# EAGLE design analog (EAGLE 7.4.0)
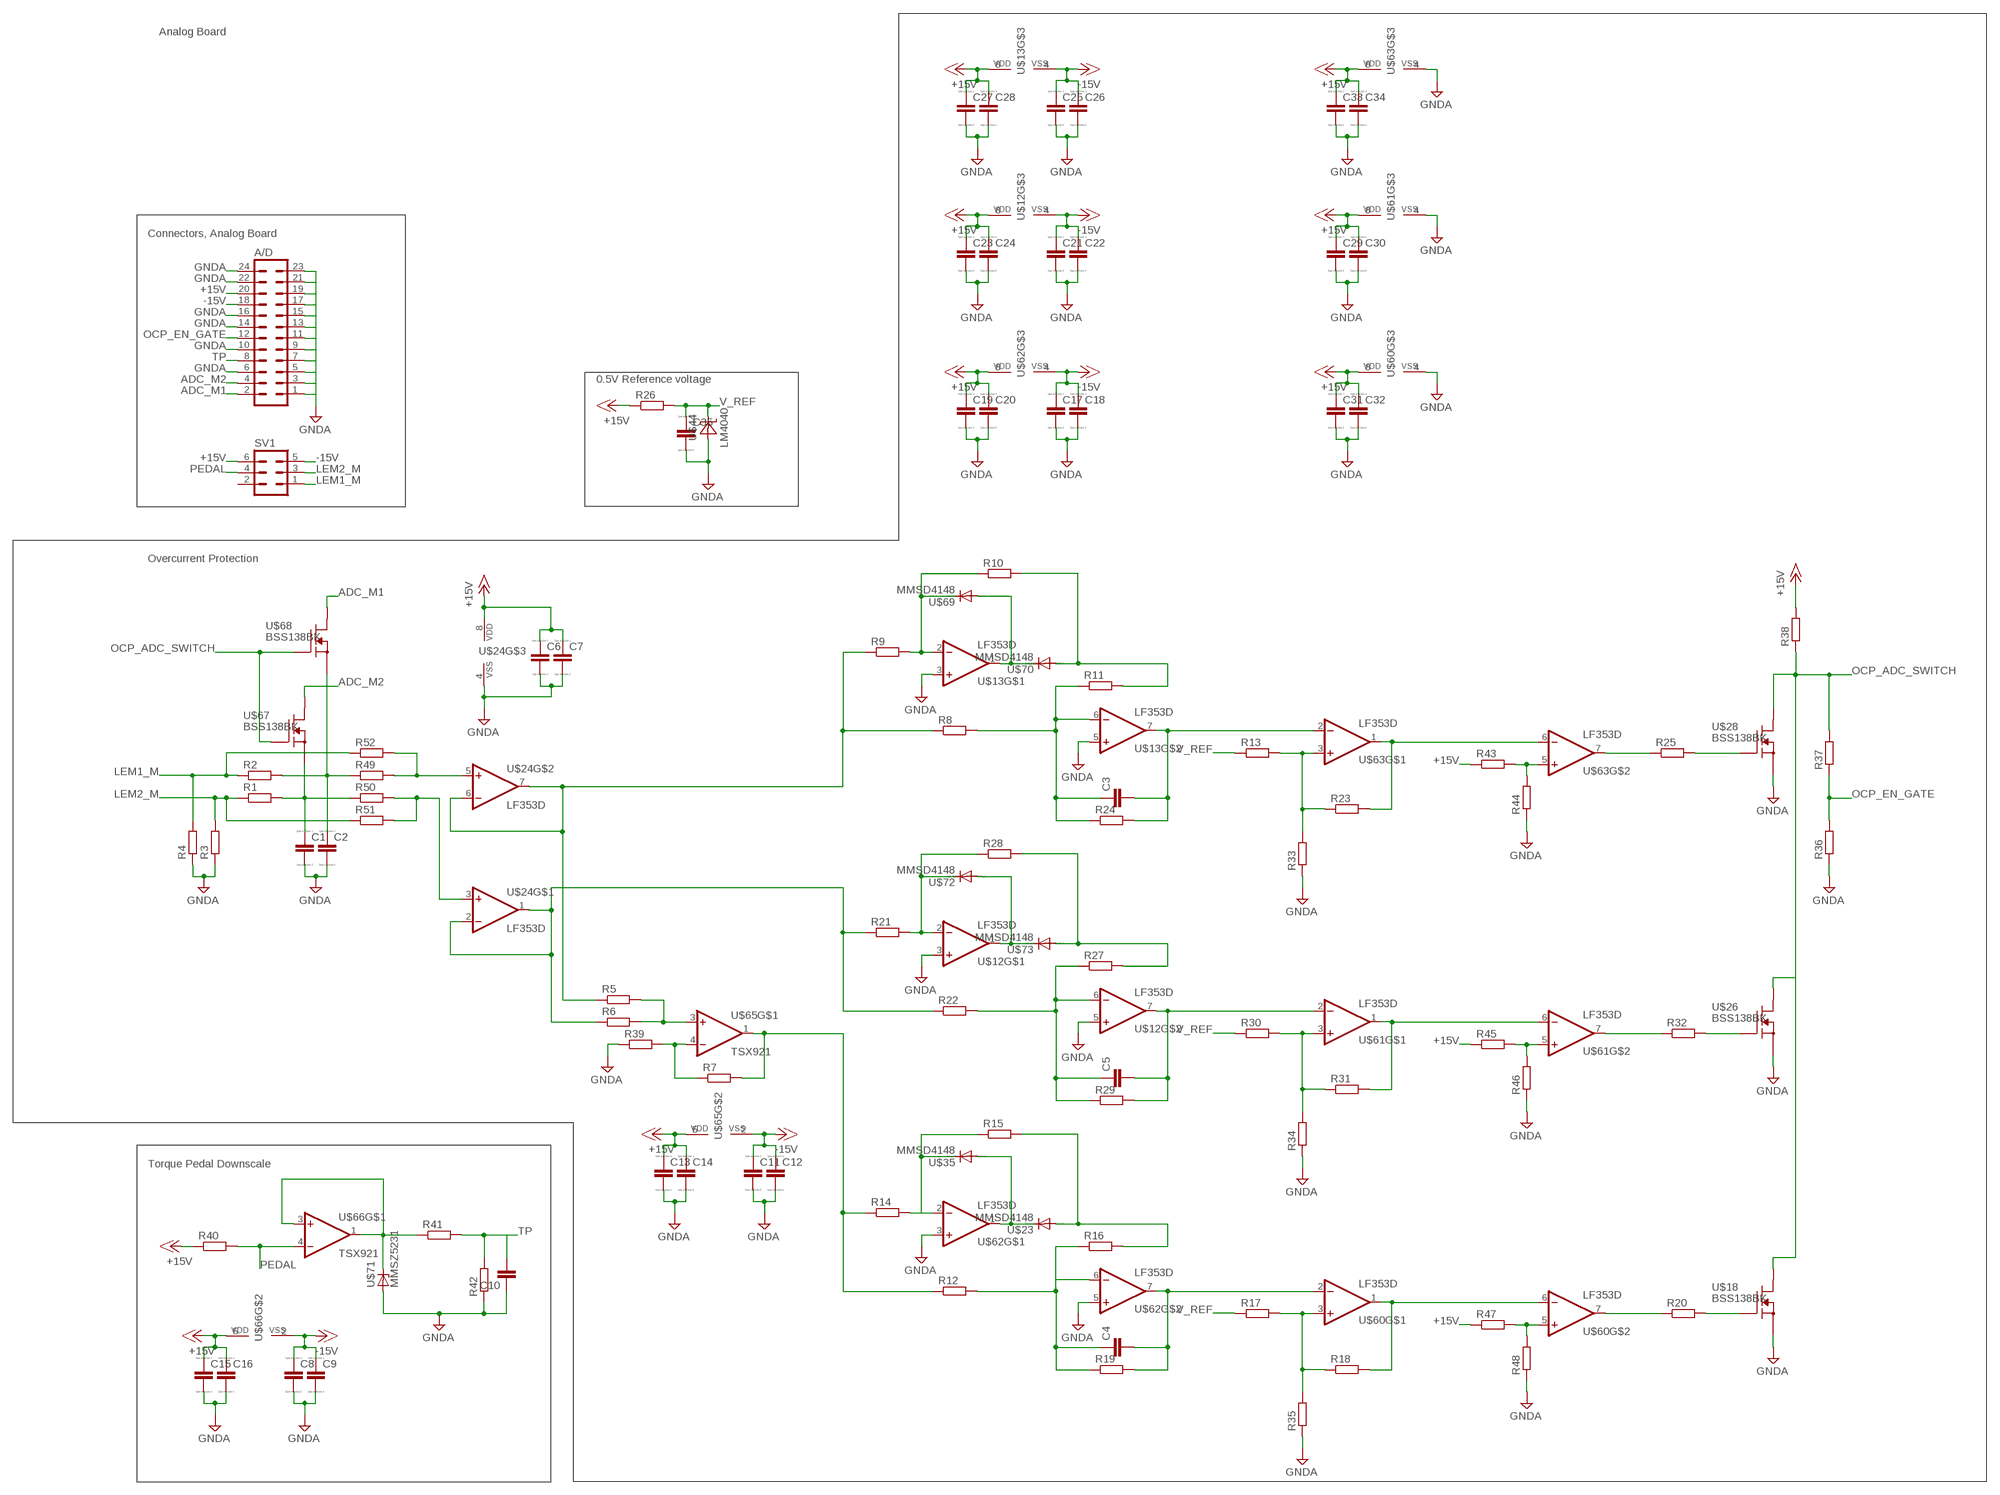
[diagram p0: schematic, sheet 1]

## Parts
A/D  MA12-2  [MA12-2]
C1  CC1206  [C1206]
C2  CC1206  [C1206]
C3  C-EUC0805  [C0805]
C4  C-EUC0805  [C0805]
C5  C-EUC0805  [C0805]
C6  CC1206  [C1206]
C7  CC1206  [C1206]
C8  CC1206  [C1206]
C9  CC1206  [C1206]
C10  C-EUC0805  [C0805]
C11  CC1206  [C1206]
C12  CC1206  [C1206]
C13  CC1206  [C1206]
C14  CC1206  [C1206]
C15  CC1206  [C1206]
C16  CC1206  [C1206]
C17  CC1206  [C1206]
C18  CC1206  [C1206]
C19  CC1206  [C1206]
C20  CC1206  [C1206]
C21  CC1206  [C1206]
C22  CC1206  [C1206]
C23  CC1206  [C1206]
C24  CC1206  [C1206]
C25  CC1206  [C1206]
C26  CC1206  [C1206]
C27  CC1206  [C1206]
C28  CC1206  [C1206]
C29  CC1206  [C1206]
C30  CC1206  [C1206]
C31  CC1206  [C1206]
C32  CC1206  [C1206]
C33  CC1206  [C1206]
C34  CC1206  [C1206]
C35  CC1206  [C1206]
R1  R-EU_M0805  [M0805]
R2  R-EU_M0805  [M0805]
R3  R-EU_M0805  [M0805]
R4  R-EU_M0805  [M0805]
R5  R-EU_M0805  [M0805]
R6  R-EU_M0805  [M0805]
R7  R-EU_M0805  [M0805]
R8  R-EU_M0805  [M0805]
R9  R-EU_M0805  [M0805]
R10  R-EU_M0805  [M0805]
R11  R-EU_M0805  [M0805]
R12  R-EU_M0805  [M0805]
R13  R-EU_M0805  [M0805]
R14  R-EU_M0805  [M0805]
R15  R-EU_M0805  [M0805]
R16  R-EU_M0805  [M0805]
R17  R-EU_M0805  [M0805]
R18  R-EU_M0805  [M0805]
R19  R-EU_M0805  [M0805]
R20  R-EU_M0805  [M0805]
R21  R-EU_M0805  [M0805]
R22  R-EU_M0805  [M0805]
R23  R-EU_M0805  [M0805]
R24  R-EU_M0805  [M0805]
R25  R-EU_M0805  [M0805]
R26  R-EU_M0805  [M0805]
R27  R-EU_M0805  [M0805]
R28  R-EU_M0805  [M0805]
R29  R-EU_M0805  [M0805]
R30  R-EU_M0805  [M0805]
R31  R-EU_M0805  [M0805]
R32  R-EU_M0805  [M0805]
R33  R-EU_M0805  [M0805]
R34  R-EU_M0805  [M0805]
R35  R-EU_M0805  [M0805]
R36  R-EU_M0805  [M0805]
R37  R-EU_M0805  [M0805]
R38  R-EU_M0805  [M0805]
R39  R-EU_M0805  [M0805]
R40  R-EU_M0805  [M0805]
R41  R-EU_M0805  [M0805]
R42  R-EU_M0805  [M0805]
R43  R-EU_M0805  [M0805]
R44  R-EU_M0805  [M0805]
R45  R-EU_M0805  [M0805]
R46  R-EU_M0805  [M0805]
R47  R-EU_M0805  [M0805]
R48  R-EU_M0805  [M0805]
R49  R-EU_M0805  [M0805]
R50  R-EU_M0805  [M0805]
R51  R-EU_M0805  [M0805]
R52  R-EU_M0805  [M0805]
SV1  MA03-2  [MA03-2]
U$12  LF353D  [SO08]
U$13  LF353D  [SO08]
U$18  BSS138BK  [SOT23]
U$23  MMSD4148  [SOD123]
U$24  LF353D  [SO08]
U$26  BSS138BK  [SOT23]
U$28  BSS138BK  [SOT23]
U$35  MMSD4148  [SOD123]
U$44  LM4040  [SOT23]
U$60  LF353D  [SO08]
U$61  LF353D  [SO08]
U$62  LF353D  [SO08]
U$63  LF353D  [SO08]
U$65  TSX921  [SOT23-5]
U$66  TSX921  [SOT23-5]
U$67  BSS138BK  [SOT23]
U$68  BSS138BK  [SOT23]
U$69  MMSD4148  [SOD123]
U$70  MMSD4148  [SOD123]
U$71  MMSZ5231  [SOD123]
U$72  MMSD4148  [SOD123]
U$73  MMSD4148  [SOD123]

## Nets
+15V: A/D.20 C6.1 C7.1 C13.1 C14.1 C15.1 C16.1 C19.1 C20.1 C23.1 C24.1 C27.1 C28.1 C29.1 C30.1 C31.1 C32.1 C33.1 C34.1 R26.1 R38.2 R40.1 R43.1 R45.1 R47.1 SV1.6 U$12.8(VDD) U$13.8(VDD) U$24.8(VDD) U$60.8(VDD) U$61.8(VDD) U$62.8(VDD) U$63.8(VDD) U$65.5(VDD) U$66.5(VDD)
-15V: A/D.18 C8.1 C9.1 C11.1 C12.1 C17.1 C18.1 C21.1 C22.1 C25.1 C26.1 SV1.5 U$12.4(VSS) U$13.4(VSS) U$62.4(VSS) U$65.2(VSS) U$66.2(VSS)
ADC_M1: A/D.2 U$68.3(D)
ADC_M2: A/D.4 U$67.3(D)
GNDA: A/D.1 A/D.3 A/D.5 A/D.6 A/D.7 A/D.9 A/D.10 A/D.11 A/D.13 A/D.14 A/D.15 A/D.16 A/D.22 A/D.23 A/D.24 C1.2 C2.2 C6.2 C7.2 C8.2 C9.2 C10.1 C11.2 C12.2 C13.2 C14.2 C15.2 C16.2 C17.2 C18.2 C19.2 C20.2 C21.2 C22.2 C23.2 C24.2 C25.2 C26.2 C27.2 C28.2 C29.2 C30.2 C31.2 C32.2 C33.2 C34.2 C35.2 R3.1 R4.1 R33.1 R34.1 R35.1 R36.1 R39.1 R42.1 R44.1 R46.1 R48.1 U$12.3(+IN) U$12.5(+IN) U$13.3(+IN) U$13.5(+IN) U$18.2(S) U$24.4(VSS) U$26.2(S) U$28.2(S) U$44.1(A) U$60.4(VSS) U$61.4(VSS) U$62.3(+IN) U$62.5(+IN) U$63.4(VSS) U$71.A
LEM1_M: R2.1 R4.2 R52.1 SV1.1
LEM2_M: R1.1 R3.2 R51.1 SV1.3
N$1: R50.2 R51.2 U$24.3(+IN)
N$2: R5.1 R8.1 R9.1 U$24.6(-IN) U$24.7(OUT)
N$3: R9.2 R10.1 U$13.2(-IN) U$69.C
N$4: C2.1 R2.2 R49.1 U$68.2(S)
N$5: R13.2 R23.1 R33.2 U$63.3(+IN)
N$6: R5.2 R6.2 U$65.3(+IN)
N$7: R7.2 R12.1 R14.1 U$65.1(OUT)
N$8: C3.1 R8.2 R11.1 R24.1 U$13.6(-IN)
N$9: R10.2 R11.2 U$70.A
N$10: C3.2 R24.2 U$13.7(OUT) U$63.2(-IN)
N$11: U$13.1(OUT) U$69.A U$70.C
N$12: R6.1 R21.1 R22.1 U$24.1(OUT) U$24.2(-IN)
N$13: R14.2 R15.1 U$35.C U$62.2(-IN)
N$14: C4.1 R12.2 R16.1 R19.1 U$62.6(-IN)
N$15: U$23.C U$35.A U$62.1(OUT)
N$16: R15.2 R16.2 U$23.A
N$17: C4.2 R19.2 U$60.2(-IN) U$62.7(OUT)
N$18: R23.2 U$63.1(OUT) U$63.6(-IN)
N$19: R17.2 R18.1 R35.2 U$60.3(+IN)
N$20: R18.2 U$60.1(OUT) U$60.6(-IN)
N$21: R32.1 U$61.7(OUT)
N$22: R7.1 R39.2 U$65.4(-IN)
N$23: R21.2 R28.1 U$12.2(-IN) U$72.C
N$24: C5.1 R22.2 R27.1 R29.1 U$12.6(-IN)
N$25: U$12.1(OUT) U$72.A U$73.C
N$26: R27.2 R28.2 U$73.A
N$27: C5.2 R29.2 U$12.7(OUT) U$61.2(-IN)
N$28: A/D.21
N$29: R30.2 R31.1 R34.2 U$61.3(+IN)
N$30: R31.2 U$61.1(OUT) U$61.6(-IN)
N$31: R45.2 R46.2 U$61.5(+IN)
N$32: R25.1 U$63.7(OUT)
N$33: R25.2 U$28.1(G)
N$34: R32.2 U$26.1(G)
N$35: R20.2 U$18.1(G)
N$36: A/D.19
N$37: R41.1 U$66.1(OUT) U$66.3(+IN) U$71.C
N$38: R43.2 R44.2 U$63.5(+IN)
N$39: R47.2 R48.2 U$60.5(+IN)
N$40: R20.1 U$60.7(OUT)
N$41: R49.2 R52.2 U$24.5(+IN)
N$42: C1.1 R1.2 R50.1 U$67.2(S)
N$43: A/D.17
OCP_ADC_SWITCH: R37.2 R38.1 U$18.3(D) U$26.3(D) U$28.3(D) U$67.1(G) U$68.1(G)
OCP_EN_GATE: A/D.12 R36.2 R37.1
PEDAL: R40.2 SV1.4 U$66.4(-IN)
TP: A/D.8 C10.2 R41.2 R42.2
V_REF: C35.1 R13.1 R17.1 R26.2 R30.1 U$44.2(C)
Unconnected: SV1.2

## Notes on the sheet
- Analog Board
- Connectors, Analog Board
- 0.5V Reference voltage
- Overcurrent Protection
- Torque Pedal Downscale

## Library data of the parts
A/D = con-lstb:MA12-2: PIN HEADER; OC_FARNELL: unknown; OC_NEWARK: unknown
C1 C2 C6-C9 C11-C35 = eagle-ltspice:C: CAPACITOR, European symbol; SPICEMODEL: NONE; SPICEPREFIX: C
C3-C5 C10 = rcl:C-EU: CAPACITOR, European symbol
R1-R52 = rcl:R-EU_: RESISTOR, European symbol
SV1 = con-lstb:MA03-2: PIN HEADER; OC_FARNELL: unknown; OC_NEWARK: unknown
U$12 U$13 U$24 U$60-U$63 = custom_parts:LF353D
U$18 U$26 U$28 U$67 U$68 = custom_parts:BSS138BK
U$23 U$35 U$69 U$70 U$72 U$73 = custom_parts:MMSD4148
U$44 = custom_parts:LM4040
U$65 U$66 = custom_parts:TSX921
U$71 = custom_parts:MMSZ5231

## Board
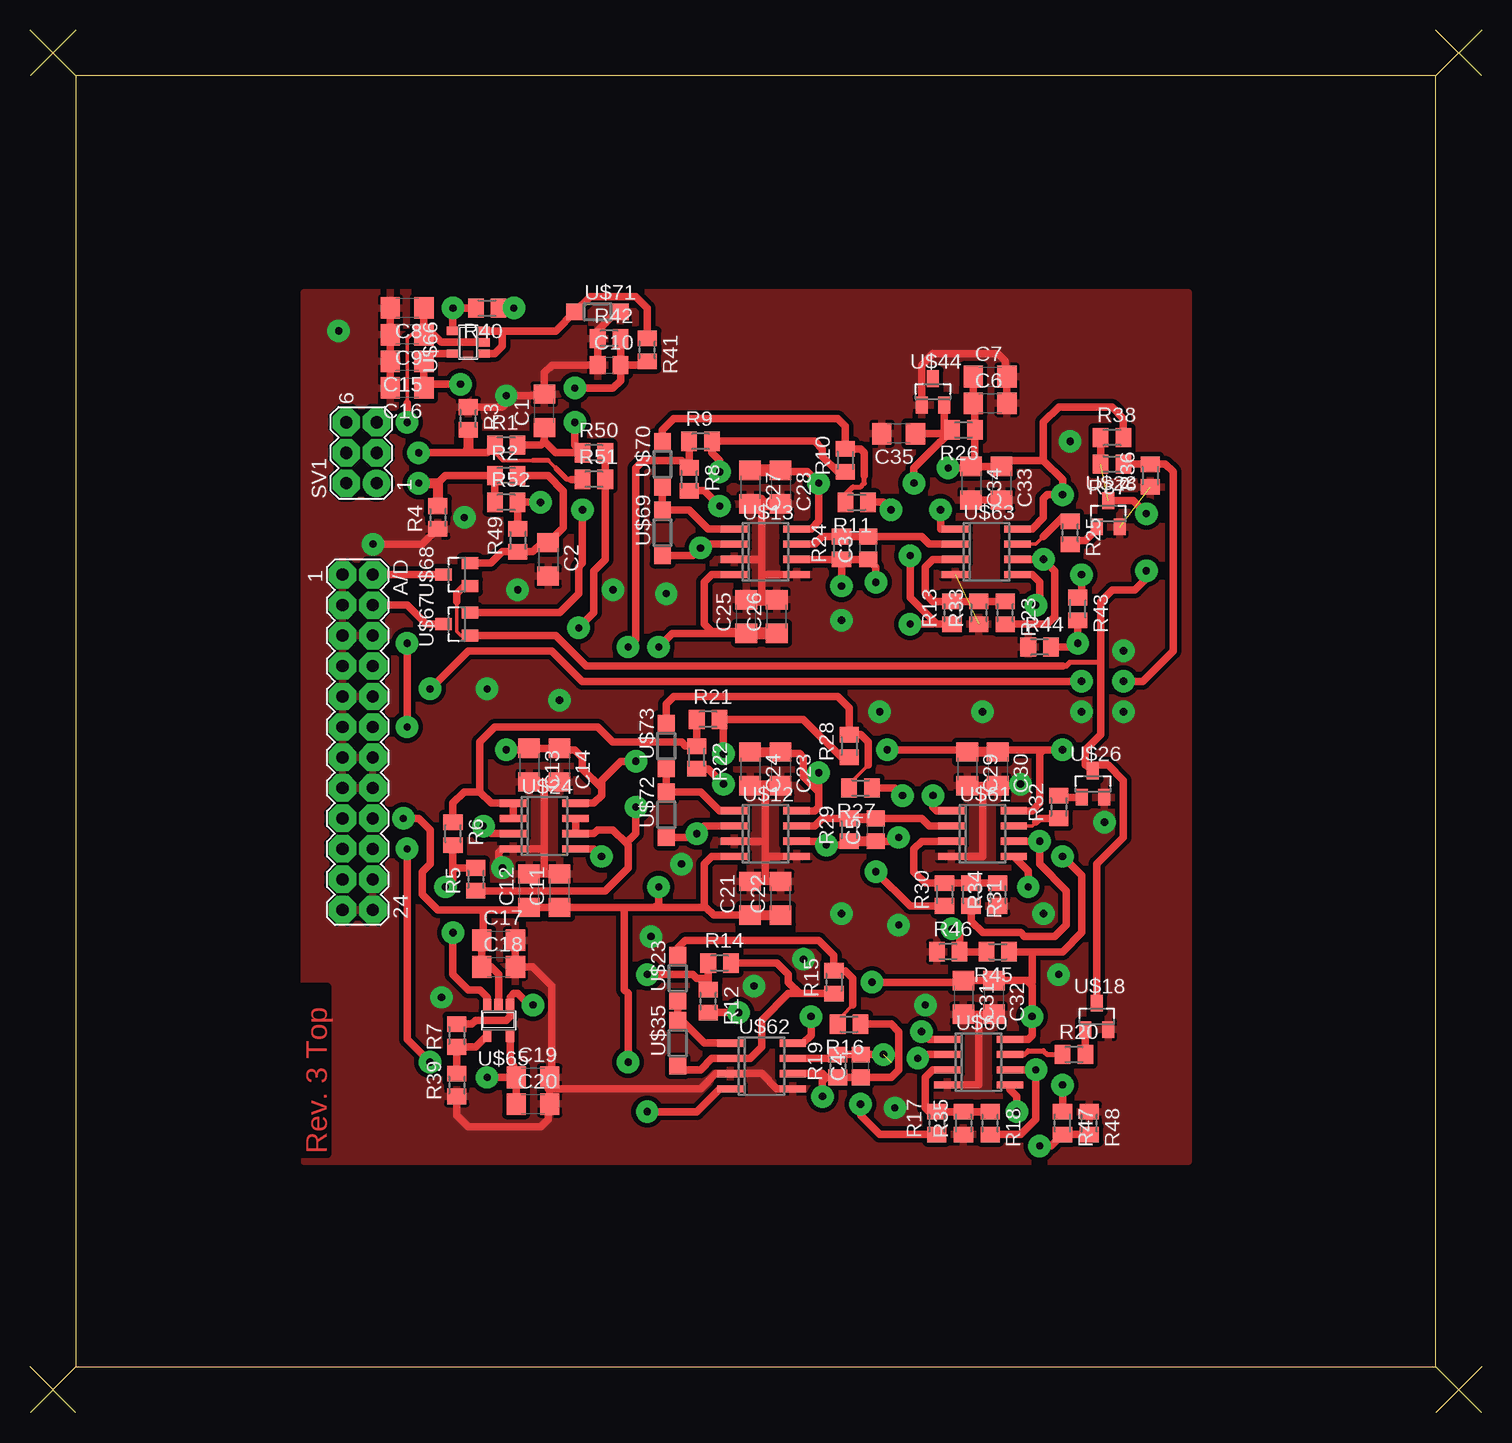
[diagram p1: board, top side]
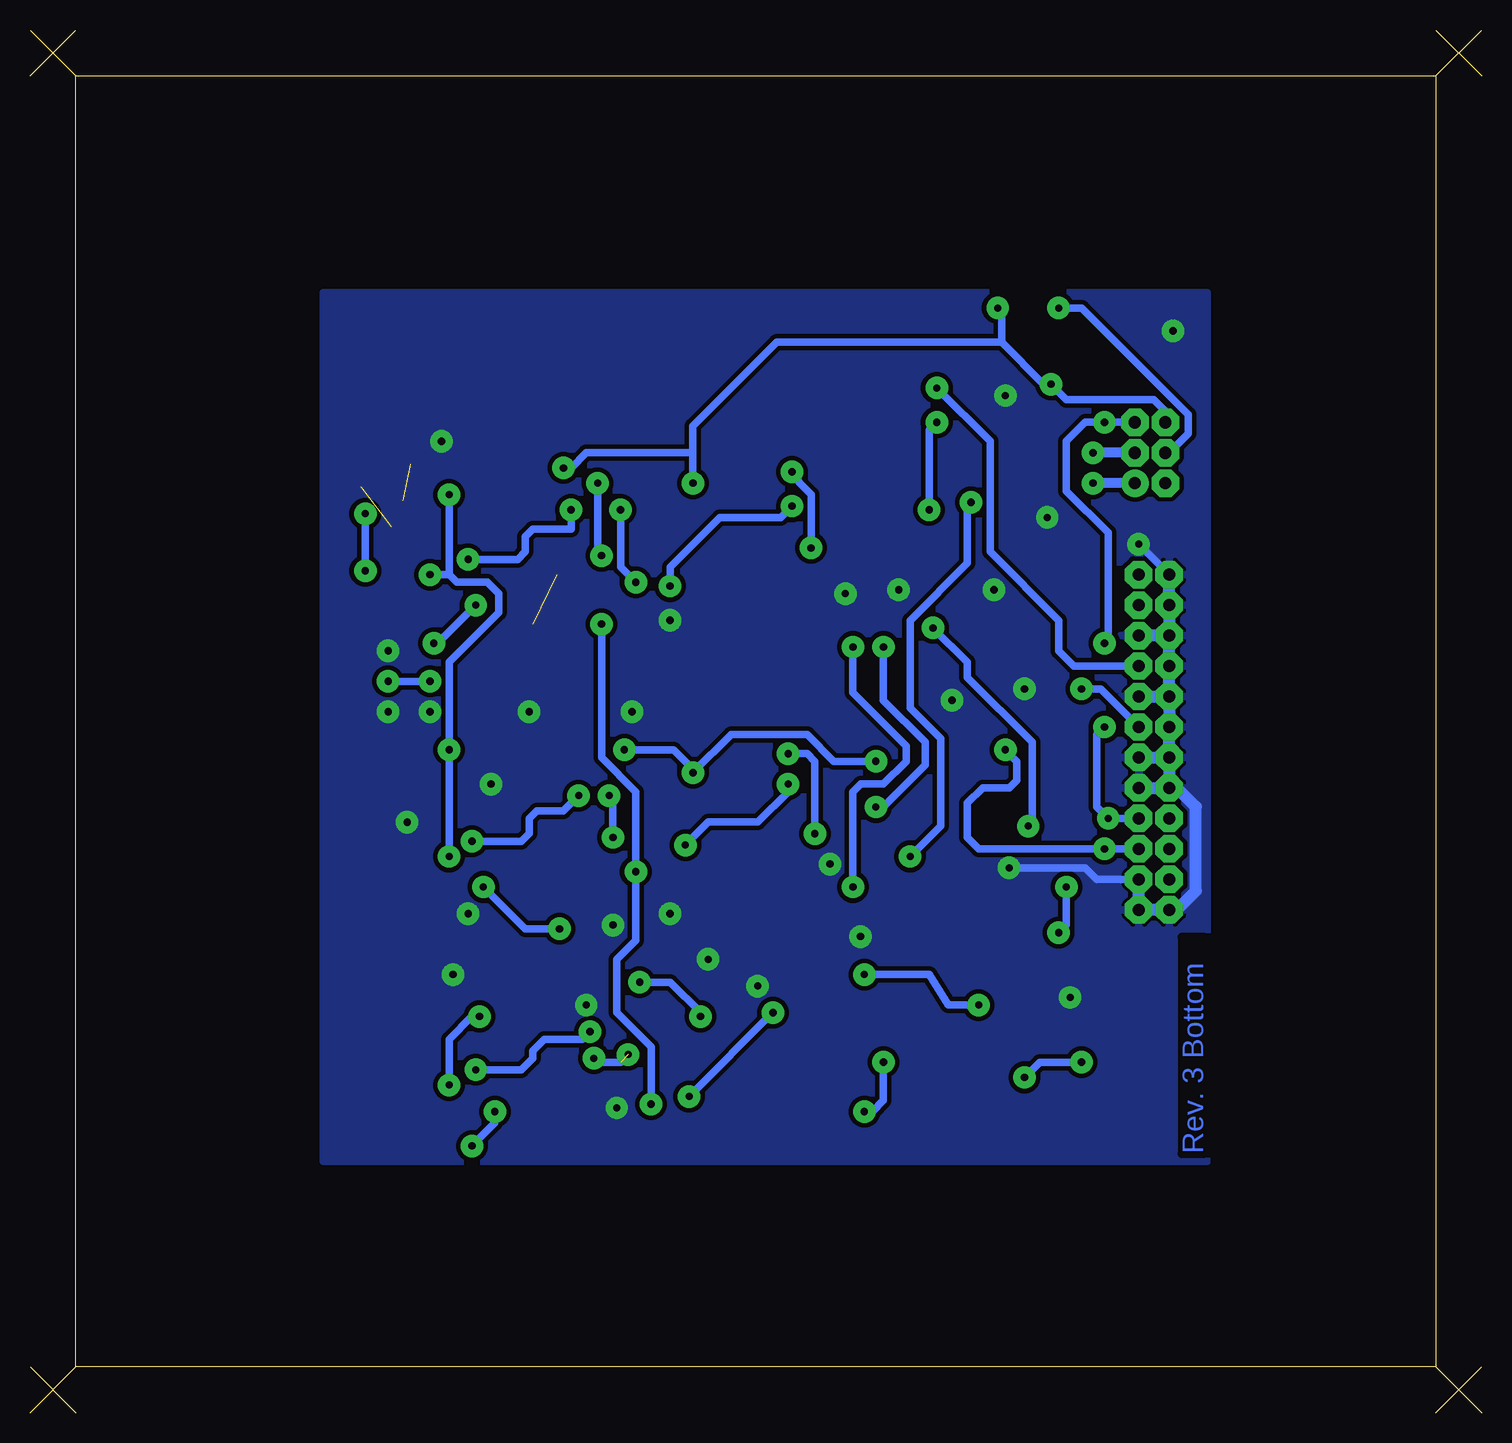
[diagram p2: board, bottom side, seen from below]

Size 120.97 x 115.25 mm. Coordinates in mm from the lower left corner, seen from the top.
Outline: 3.81,3.81 117.14,3.81 117.14,111.43 3.81,111.43 3.81,3.81
Outline: 3.81,111.44 0,115.25
Outline: 3.81,115.25 0,111.44
Outline: 120.97,111.44 117.16,115.25
Outline: 120.97,115.25 117.16,111.44
Outline: 120.97,0 117.16,3.81
Outline: 120.97,3.81 117.16,0
Outline: 3.81,0 0,3.81
Outline: 3.81,3.81 0,0
Copper layers (1*16): Top 0.035mm / dielectric 1.5mm / Bottom 0.035mm
Design rules "default *": minimum track width 10mil, minimum drill 24mil, track to track 15mil, track to pad 15mil, pad to pad 15mil, via to via 15mil, smd to smd 8mil, copper to edge 40mil, drill to drill 8mil, minimum pad ring 25mil, minimum via ring 25mil, stop-mask expansion 4mil, vias tented up to drill 0mil, thermal gap 10mil

### Footprints (pad centres in the part's own frame; a part is rotated, then mirrored left to right if it is on the bottom)
MA12-2 = drill 1.016 octagon: 1 -13.97,-1.27; 2 -13.97,1.27; 3 -11.43,-1.27; 4 -11.43,1.27; 5 -8.89,-1.27; 6 -8.89,1.27; 7 -6.35,-1.27; 8 -6.35,1.27; 9 -3.81,-1.27; 10 -3.81,1.27; 11 -1.27,-1.27; 12 -1.27,1.27; 13 1.27,-1.27; 14 1.27,1.27; 15 3.81,-1.27; 16 3.81,1.27; 17 6.35,-1.27; 18 6.35,1.27; 19 8.89,-1.27; 20 8.89,1.27; 21 11.43,-1.27; 22 11.43,1.27; 23 13.97,-1.27; 24 13.97,1.27
C1206 = smd 1.6 x 1.8: 1 -1.4,0; 2 1.4,0
C0805 = smd 1.3 x 1.5: 1 -0.95,0; 2 0.95,0
M0805 = smd 1.3 x 1.6: 1 -0.95,0; 2 0.95,0
MA03-2 = drill 1.016: 1 -2.54,-1.27 | drill 1.016 octagon: 2 -2.54,1.27; 3 0,-1.27; 4 0,1.27; 5 2.54,-1.27; 6 2.54,1.27
SO08 = smd 0.6 x 2.2: 1 -1.905,-2.6; 2 -0.635,-2.6; 3 0.635,-2.6; 4 1.905,-2.6; 5 1.905,2.6; 6 0.635,2.6; 7 -0.635,2.6; 8 -1.905,2.6
SOT23 = smd 1 x 1.4: 1 -0.95,-1.1; 2 0.95,-1.1; 3 0,1.1
SOD123 = smd 1.4 x 1.4: A 1.9,0; C -1.9,0
SOT23-5 = smd 0.69 x 0.99: 1 -0.95,-1.29; 2 0,-1.29; 3 0.95,-1.29; 4 0.95,1.3; 5 -0.95,1.3

### Placement (x,y rotation side)
A/D  27.3,55.88 270 top
C1  42.86,83.5 90 top
C2  43.18,71.12 270 top
C3  69.85,72.07 90 top
C4  69.22,28.89 90 top
C5  70.48,48.58 90 top
C6  80.01,84.14 0 top
C7  80.01,86.36 0 top
C8  31.43,92.07 180 top
C9  31.43,89.85 180 top
C10  48.26,87.31 0 top
C11  44.13,43.5 90 top
C12  41.59,43.5 90 top
C13  41.59,53.98 270 top
C14  44.13,53.98 270 top
C15  31.43,87.63 180 top
C16  31.43,85.41 180 top
C17  39.05,39.37 0 top
C18  39.05,37.15 0 top
C19  41.91,27.94 0 top
C20  41.91,25.72 0 top
C21  60.01,42.86 90 top
C22  62.55,42.86 90 top
C23  62.55,53.66 270 top
C24  60.01,53.66 270 top
C25  59.69,66.36 90 top
C26  62.23,66.36 90 top
C27  60.01,77.15 270 top
C28  62.55,77.15 270 top
C29  78.1,53.66 270 top
C30  80.64,53.66 270 top
C31  77.79,34.61 270 top
C32  80.33,34.61 270 top
C33  80.96,77.47 270 top
C34  78.42,77.47 270 top
C35  72.39,81.6 180 top
R1  39.69,80.65 0 top
R2  39.69,78.1 0 top
R3  36.51,82.87 270 top
R4  33.97,74.61 90 top
R5  37.15,44.45 90 top
R6  35.24,48.26 270 top
R7  35.56,31.43 90 top
R8  54.93,77.79 270 top
R9  55.88,80.96 0 top
R10  67.94,79.38 90 top
R11  68.9,75.88 180 top
R12  56.52,34.29 270 top
R13  76.84,66.68 90 top
R14  57.47,37.47 0 top
R15  66.99,35.88 90 top
R16  68.26,32.39 180 top
R17  75.56,24.13 90 top
R18  80.01,24.13 270 top
R19  67.31,28.89 90 top
R20  87,29.85 0 top
R21  56.52,57.79 0 top
R22  55.56,54.61 270 top
R23  81.28,66.68 270 top
R24  67.63,72.07 90 top
R25  86.68,73.34 270 top
R26  77.79,81.91 180 top
R27  69.22,52.07 180 top
R28  68.26,55.56 90 top
R29  68.26,48.58 90 top
R30  76.2,43.18 90 top
R31  78.42,43.18 270 top
R32  85.72,50.48 90 top
R33  79.06,66.68 90 top
R34  80.64,43.18 90 top
R35  77.79,24.13 90 top
R36  93.34,78.1 90 top
R37  90.17,79.06 180 top
R38  90.17,81.28 0 top
R39  35.56,27.3 90 top
R40  38.1,92.07 180 top
R41  51.44,88.58 270 top
R42  48.26,89.53 0 top
R43  87.31,66.99 270 top
R44  84.14,63.82 0 top
R45  80.64,38.42 180 top
R46  76.52,38.42 0 top
R47  86.04,24.13 270 top
R48  88.27,24.13 270 top
R49  40.64,72.71 90 top
R50  46.99,80.01 0 top
R51  46.99,77.79 0 top
R52  39.69,75.88 0 top
SV1  27.62,80.01 90 top
U$12  61.28,48.26 270 top
U$13  61.28,71.75 270 top
U$18  88.9,33.02 0 top
U$23  53.97,36.2 90 top
U$24  42.86,48.9 270 top
U$26  88.58,52.39 0 top
U$28  89.85,74.93 0 top
U$35  53.97,30.8 90 top
U$44  75.25,85.09 0 top
U$60  79.06,29.21 270 top
U$61  79.38,48.26 270 top
U$62  60.96,28.89 270 top
U$63  79.69,71.75 270 top
U$65  39.05,32.7 180 top
U$66  36.51,89.22 90 top
U$67  35.56,65.72 90 top
U$68  35.56,69.85 90 top
U$69  52.7,73.34 90 top
U$70  52.7,79.06 90 top
U$71  47.31,91.76 0 top
U$72  53.02,49.85 90 top
U$73  53.02,55.56 90 top

### Tracks (layer width: path | path; a pad name or v marks a point on that pad's centre or on a via)
+15V  (via drill 0.6)
  Top 0.61: U$13.8 65.09,73.66 65.72,74.3 v65.72,77.47 64.77,78.42 62.36,78.42 C28.1 | C34.1 C33.1 | 81.09,78.74 C33.1 | C7.1 C6.1 78.74,84 R26.1 78.74,79.19 C34.1 | R38.2 91.12,82.87 90.17,83.82 85.72,83.82 84.45,82.55 84.45,79.38 | v76.52,78.74 78.29,78.74 C34.1 | U$61.8 83.5,50.16 84.14,50.8 84.14,54.93 84.45,55.24 | 42.23,55.38 C14.1 44.26,55.24 45.4,55.24 46.04,54.61 46.04,53.66 47.62,52.07 | 42.23,55.38 C13.1 | U$24.8 46.99,50.8 47.62,51.44 47.62,52.07 | v39.69,55.24 42.1,55.24 42.23,55.38 | C19.1 C20.1 | U$65.5 40,29.21 40.32,28.89 40.32,28.13 C19.1 | 83.06,36.01 C32.1 C31.1 77.66,35.88 v70.17,35.88 | 83.06,36.01 83.5,35.56 v83.5,33.02 83.5,31.43 83.19,31.12 U$60.8 | 83.06,36.01 83.37,36.01 83.5,35.88 83.5,38.42 | 80.78,54.93 C30.1 80.83,55.24 84.45,55.24 | U$12.8 65.41,50.16 65.72,50.48 65.72,51.75 | 65.72,51.75 64.45,53.02 64.45,54.61 64.13,54.93 62.68,54.93 C23.1 | 65.72,51.75 v65.72,53.34 | v71.44,55.24 77.92,55.24 C29.1 | U$62.8 64.45,30.8 65.09,31.43 v65.09,33.02 | v31.43,46.99 31.43,31.12 v33.34,29.21 | v38.1,27.94 C19.1 | 47.62,52.07 47.62,52.7 49.21,54.29 v50.48,54.29 | v35.88,85.72 33.15,85.72 C16.1 C15.1 33.47,88.27 U$66.5 | v40.32,92.07 R40.1 | R47.1 v86.04,27.3 | 83.5,38.42 R45.1 | 84.45,79.38 81.47,79.38 C33.1 | 84.45,79.38 86.04,77.79 v86.04,76.52 84.77,76.52 84.45,76.2 84.45,74.61 83.5,73.66 U$63.8 | 84.45,55.24 v86.04,55.24 | v87.63,69.85 87.63,68.26 R43.1 | 83.5,38.42 86.04,38.42 87.63,40.01 87.63,44.77 v86.04,46.36
  Top 0.813: C24.1 C23.1 | C30.1 C29.1
  Top 1.016: C27.1 C28.1
  Bottom 0.61: A/D.20 v31.43,46.99 41.91,46.99 42.86,47.94 42.86,50.8 41.59,52.07 39.37,52.07 38.73,52.7 38.73,54.29 v39.69,55.24 | v86.04,46.36 v86.04,55.24 86.04,62.55 81.91,66.68 81.91,68.26 82.87,69.22 85.41,69.22 86.04,69.85 | v71.44,55.24 67.31,55.24 65.72,53.66 v65.72,53.34 62.55,56.52 56.2,56.52 53.97,54.29 v50.48,54.29 | v65.09,33.02 65.09,33.34 67.63,35.88 v70.17,35.88 | v33.34,29.21 36.83,29.21 v38.1,27.94 | SV1.6 26.35,83.5 27.3,84.46 34.61,84.46 v35.88,85.72 36.51,85.72 40,89.22 | 40,89.22 40,91.76 v40.32,92.07 | 40,89.22 58.74,89.22 65.72,82.23 65.72,80.01 | 65.72,80.01 v65.72,77.47 | 86.04,69.85 v86.04,76.52 | v83.5,33.02 84.14,33.02 86.04,31.12 v86.04,27.3 | v76.52,78.74 75.88,78.74 74.61,80.01 65.72,80.01 | v87.63,69.85 86.04,69.85
-15V  (via drill 0.6)
  Top 0.305: C9.1 31.75,89.85 31.43,89.53 31.43,84.14
  Top 0.61: U$13.4 56.83,69.85 56.2,69.22 56.2,65.72 56.83,65.09 59.56,65.09 C25.1 53.53,64.96 v52.39,63.82 | C21.1 56.96,41.46 56.33,42.1 | 56.33,42.1 56.2,42.23 56.2,45.72 56.83,46.36 U$12.4 | v31.12,49.53 32.38,49.53 33.34,48.58 33.34,45.72 32.7,45.09 32.7,43.18 33.97,41.91 37.78,41.91 | 37.78,41.91 41.41,41.91 C12.1 C11.1 49.53,42.1 | 49.53,42.1 52.07,42.1 | 52.07,42.1 56.33,42.1 | U$65.2 39.05,36.51 38.42,37.15 C18.1 C17.1 37.78,39.5 37.78,41.91 | U$62.4 57.47,26.99 55.56,25.08 v51.44,25.08 | v49.85,29.21 49.85,34.92 49.53,35.24 49.53,42.1 | v52.39,43.81 52.39,42.41 52.07,42.1 | C8.1 C9.1 33.66,89.85 34.29,89.22 U$66.2 | v31.43,82.55 31.43,84.14 | v31.43,64.13 v31.43,57.15
  Top 0.813: C21.1 C22.1
  Top 1.016: C26.1 C25.1
  Bottom 0.61: A/D.18 v31.12,49.53 32.07,50.48 32.07,56.52 v31.43,57.15 | v49.85,29.21 49.85,26.04 50.8,25.08 v51.44,25.08 | v52.39,43.81 52.39,51.75 51.75,52.39 49.85,52.39 47.94,54.29 47.94,55.56 52.39,60.01 v52.39,63.82 | v31.43,64.13 31.12,64.45 31.12,73.34 34.61,76.84 34.61,80.96 33.02,82.55 v31.43,82.55 SV1.5
ADC_M1
  Top 0.61: U$68.3 A/D.2
ADC_M2
  Top 0.61: U$67.3 33.02,65.72 31.43,67.31 A/D.4
GNDA  (via drill 0.6)  (2 unrouted)
  Top 0.61: C27.2 60.83,76.07 60.96,76.2 60.96,71.12 | 60.96,71.12 U$13.3 | U$13.5 60.96,69.85 | 60.96,69.85 60.96,71.12 | 60.96,69.85 60.96,67.76 | C33.2 C34.2 | C6.2 C7.2 81.28,86.49 81.28,87.63 80.64,88.27 75.25,88.27 74.3,87.31 U$44.1 | C30.2 78.87,52.26 78.74,52.39 78.61,52.26 C29.2 | C30.2 79.56,52.26 79.38,52.07 79.38,46.36 U$61.4 | C24.2 61.28,52.26 61.28,47.62 | 61.28,47.62 61.28,46.04 | 61.28,46.04 61.28,44.26 | C22.2 61.28,44.26 | 61.28,44.26 C21.2 | C30.2 82.42,52.26 v82.55,52.39 | C13.2 42.55,52.58 | 42.55,52.58 C14.2 | 42.86,46.99 U$24.4 39.37,46.99 39.05,46.67 39.05,45.72 v39.37,45.4 | 42.86,46.99 42.86,52.26 42.55,52.58 | C12.2 42.86,44.9 | 42.86,44.9 C11.2 | 42.86,46.99 42.86,44.9 | C19.2 C20.2 43.18,25.59 43.18,24.45 42.55,23.81 36.51,23.81 35.56,24.77 R39.1 | C17.2 C18.2 41.91,37.15 43.5,35.56 43.5,28.13 C19.2 | 43.18,28.07 C19.2 | v28.57,72.39 32.7,72.39 R4.1 | U$62.5 62.23,26.99 60.96,28.26 U$62.3 57.15,28.26 55.88,26.99 43.18,26.99 43.31,27.12 C19.2 | C32.2 C31.2 78.87,33.21 79.06,33.02 79.06,27.3 U$60.4 | U$12.3 61.28,47.62 | U$12.5 61.59,46.36 61.28,46.04 | C16.2 C15.2 C9.2 C8.2 | R3.1 39.37,83.82 40.32,84.77 42.73,84.77 C1.2 42.86,86.68 43.5,87.31 C10.1 R42.1 47.31,90.17 48.89,91.76 U$71.A
  Top 0.813: C23.2 C24.2
  Top 1.016: C27.2 C28.2 | C25.2 60.96,67.76 C26.2
  Bottom 0.61: v39.37,45.4 33.02,45.4 32.07,44.45 A/D.22 | A/D.1 v28.57,72.39
  Bottom 1.016: A/D.10 A/D.9 | A/D.14 A/D.13 | A/D.16 A/D.15 | A/D.13 A/D.15 | A/D.13 A/D.11 A/D.9 | A/D.9 A/D.7 A/D.5 | A/D.5 A/D.6 | A/D.1 A/D.3 A/D.5 | A/D.22 A/D.24 A/D.23 25.4,41.91 23.81,43.5 23.81,50.48 25.4,52.07 A/D.15
  other vias: 89.53,49.21 72.39,40.64 84.45,41.59 67.63,41.59 48.58,68.58 36.2,74.61 79.38,58.42 51.75,39.69 60.33,35.56 85.72,36.51 34.29,34.61 72.07,25.4 44.13,59.37 86.68,80.96 74.61,33.97 91.12,63.5 91.12,58.42 87.63,58.42 70.8,58.42 67.63,66.04 40.64,68.58 38.1,60.33 39.69,84.77 25.72,90.17 54.29,45.72 64.45,37.78 53.02,68.26
  pour Bottom: 22.86,93.34 96.52,93.34 96.52,20.96 22.86,20.96
  pour Top: 96.52,20.96 22.86,20.96 22.86,93.34 96.52,93.34
LEM1_M  (via drill 0.6)
  Top 0.61: R52.1 R2.1 34.61,78.1 33.97,77.47
  Top 0.813: v32.38,77.47 33.97,77.47 R4.2
  Bottom 0.813: SV1.1 v32.38,77.47
LEM2_M  (via drill 0.6)
  Top 0.305: R1.1 38.73,80.01 39.37,79.38 41.91,79.38 | 43.81,78.74 43.18,79.38
  Top 0.406: 45.09,77.79 44.77,77.79 43.81,78.74 | 43.18,79.38 41.91,79.38
  Top 0.61: R51.1 45.09,77.79 | v32.38,80.01 36.2,80.01 | 36.2,80.01 38.1,80.01 R1.1 | 36.51,80.33 36.2,80.01
  Top 0.813: R3.2 36.51,80.33
  Bottom 0.813: SV1.3 v32.38,80.01
N$1  (via drill 0.6)
  Top 0.61: R50.2 R51.2 47.94,75.25 47.94,75.24 47.94,71.12 46.99,70.17 46.99,66.68 v45.72,65.41 | v37.78,48.9 38.42,48.26 U$24.3
  Bottom 0.61: v45.72,65.41 42.86,62.55 42.86,61.28 37.47,55.88 37.47,49.21 v37.78,48.9
N$2  (via drill 0.6)
  Top 0.61: U$24.7 U$24.6 46.99,48.26 47.31,48.58 48.58,48.58 49.69,47.47 | 49.69,47.47 49.85,47.31 49.85,45.4 47.94,43.5 R5.1 | v49.85,63.82 50.48,64.45 50.48,78.74 51.12,79.38 54.29,79.38 R8.1 R9.1 | v50.48,50.48 50.48,48.26 49.69,47.47
  Bottom 0.61: v49.85,63.82 49.85,59.37 46.36,55.88 46.36,53.98 49.85,50.48 v50.48,50.48
N$3  (via drill 0.6)
  Top 0.61: R10.1 67.31,78.43 66.04,79.69 66.04,80.33 65.41,80.96 R9.2 56.83,80.01 57.47,79.38 v57.47,78.42 | U$69.C 53.34,71.44 55.24,71.44 v55.88,72.07 56.2,72.39 U$13.2
  Bottom 0.61: v57.47,78.42 56.83,77.47 55.88,76.52 v55.88,72.07
N$4
  Top 0.61: R2.2 43.18,78.1 44.45,76.84 44.45,73.79 C2.1 42.67,72.52 41.91,71.75 R49.1 39.37,71.75 38.41,70.8 U$68.2
N$5
  Top 0.61: R23.1 R33.2 78.74,67.62 R13.2 78.42,67.63 75.25,67.63 74.61,68.26 74.61,70.48 75.25,71.12 U$63.3
N$6  (via drill 0.6)
  Top 0.61: U$65.3 38.1,34.61 37.47,35.24 36.51,35.24 35.24,36.51 v35.24,40.01 | 37.14,45.09 R5.2 35.24,45.4 | R6.2 35.24,45.4 | 35.24,45.4 35.24,44.45 v34.61,43.81
  Bottom 0.61: v34.61,43.81 34.61,40.64 v35.24,40.01
N$7  (via drill 0.6)
  Top 0.61: R7.2 36.83,32.38 37.15,32.7 39.69,32.7 40,33.02 U$65.1 40,34.61 40.32,34.92 40.64,34.92 41.59,33.97 v41.91,33.97 | R12.1 56.52,36.2 | 56.52,36.2 R14.1 56.52,36.2 | 56.52,36.2 55.56,36.2 55.24,36.51 v51.44,36.51
  Bottom 0.61: v51.44,36.51 46.04,36.51 44.45,33.97 v41.91,33.97
N$8  (via drill 0.6)
  Top 0.61: 68.9,71.12 C3.1 70.48,70.49 v70.48,69.22 | 68.9,71.12 R24.1 | 68.89,71.12 68.9,71.12 | R8.2 56.2,76.84 v57.47,75.56 | R11.1 71.12,75.88 v71.75,75.25 | v67.63,68.9 R24.1 | U$13.6 R24.1
  Bottom 0.61: v71.75,75.25 71.75,70.48 v70.48,69.22 | v67.63,68.9 67.63,70.48 63.5,74.61 58.42,74.61 v57.47,75.56
N$9
  Top 0.406: R11.2 67.95,76.52 68.58,77.15 69.22,77.15 69.53,77.47 69.53,78.1
  Top 0.61: 69.53,78.1 69.53,80.01 69.22,80.33 R10.2 67.94,82.23 67.31,82.87 53.66,82.87 52.7,81.91 U$70.A
N$10
  Top 0.61: U$13.7 65.41,72.39 66.04,73.02 R24.2 C3.2 74.29,73.02 74.3,73.03 74.93,72.39 U$63.2
N$11
  Top 0.61: U$13.1 56.52,73.66 54.93,75.25 53.34,75.25 U$69.A U$70.C
N$12
  Top 0.61: R21.1 R22.1 54.61,55.56 54.29,55.88 48.58,55.88 47.31,57.15 38.73,57.15 37.47,55.88 37.47,51.75 | U$24.2 U$24.1 38.42,50.8 37.47,51.75 | R6.1 35.24,50.8 36.2,51.75 37.47,51.75
N$13
  Top 0.61: R15.1 64.13,34.93 | 64.13,34.93 63.18,35.88 63.18,36.51 62.23,37.47 R14.2 | 64.13,34.93 63.19,34.93 60.96,32.7 60.96,30.48 60.01,29.53 U$62.2 56.83,29.53 55.88,28.58 53.98,28.58 U$35.C
N$14  (via drill 0.6)
  Top 0.61: R12.2 v59.05,33.34 | U$62.6 66.04,28.26 66.36,27.94 | 66.36,27.94 R19.1 C4.1 71.76,27.94 72.39,28.58 72.39,31.75 71.75,32.39 R16.1 | v66.04,26.35 66.04,27.62 66.36,27.94
  Bottom 0.61: v59.05,33.34 v66.04,26.35
N$15
  Top 0.61: 53.97,33.02 54.13,32.86 | 54.13,32.86 56.2,30.8 U$62.1 | U$23.C U$35.A 54.13,32.86
N$16
  Top 0.305: 68.58,33.97 67.63,33.02 67.63,32.7 R16.2
  Top 0.61: 68.58,33.97 68.58,36.2 67.95,36.83 R15.2 66.99,38.1 65.72,39.37 54.61,39.37 53.97,38.73 U$23.A
N$17  (via drill 0.6)  (1 unrouted)
  Top 0.61: U$62.7 67,29.53 R19.2 C4.2 v71.12,29.85 | U$60.2 74.3,29.85 v73.98,29.53
  Bottom 0.61: 71.75,29.21 73.66,29.21 v73.98,29.53
N$18  (via drill 0.6)
  Top 0.61: R23.2 84.77,65.72 85.41,66.36 85.41,70.17 v84.45,71.12 U$63.6 | U$63.1 75.88,73.66 v75.88,75.25
  Bottom 0.61: v75.88,75.25 75.88,73.66 79.06,73.66 79.69,73.03 79.69,71.75 80.33,71.12 v84.45,71.12
N$19
  Top 0.61: R18.1 R35.2 R17.2 75.88,25.08 74.93,25.08 74.61,25.4 74.61,27.94 75.25,28.58 U$60.3
N$20  (via drill 0.6)
  Top 0.61: R18.2 80.33,23.18 82.55,23.18 83.82,24.45 v83.82,28.58 U$60.6 83.19,28.58 | v74.3,31.75 74.93,31.12 U$60.1
  Bottom 0.61: v83.82,28.58 80.01,28.58 79.06,29.53 79.06,30.16 78.1,31.12 74.93,31.12 v74.3,31.75
N$21
  Top 0.305: 83.82,49.21 83.5,48.9 U$61.7
  Top 0.61: R32.1 84.14,49.53 83.82,49.21
N$22
  Top 0.61: U$65.4 38.07,31.4 37.15,30.48 R7.1 | R7.1 | R7.1 R39.2
N$23  (via drill 0.6)
  Top 0.61: U$12.2 56.2,48.9 v55.56,48.26 55.25,47.95 U$72.C | R28.1 67.62,54.61 64.45,57.79 R21.2 57.78,57.47 v57.78,54.93
  Bottom 0.61: v55.56,48.26 55.56,54.29 56.2,54.93 v57.78,54.93
N$24  (via drill 0.6)
  Top 0.61: U$12.6 66.04,47.63 v66.36,47.31 68.58,47.31 68.9,47.63 | R22.2 56.51,53.66 v57.78,52.39 | C5.1 72.08,47.63 v72.39,47.94 | v72.71,51.44 72.07,52.07 R27.1
  Top 0.813: C5.1 68.9,47.63 R29.1
  Bottom 0.61: v57.78,52.39 57.78,51.75 60.33,49.21 64.45,49.21 v66.36,47.31 | v72.39,47.94 72.39,51.12 v72.71,51.44
N$25
  Top 0.61: U$73.C U$72.A 55.88,51.75 57.47,50.16 U$12.1
N$26
  Top 0.305: R27.2 68.58,52.38 68.58,52.7 69.85,53.98
  Top 0.61: U$73.A 53.02,59.05 53.66,59.69 67.31,59.69 68.26,58.74 R28.2 69.22,56.52 69.85,55.88 69.85,53.98
N$27
  Top 0.61: U$12.7 65.41,48.9 66.04,49.53 R29.2 | C5.2 74.3,49.53 74.93,48.9 U$61.2
  Top 0.813: C5.2 R29.2
N$29
  Top 0.61: R34.2 R31.1 R30.2 74.62,44.13 73.66,45.09 73.66,46.99 74.3,47.62 U$61.3
N$30  (via drill 0.6)
  Top 0.61: R31.2 78.42,40.96 79.38,40.01 82.55,40.01 82.87,39.69 85.41,39.69 86.36,40.64 86.36,43.5 84.14,45.72 v84.14,47.62 U$61.6 | v75.25,51.44 75.25,50.48 75.56,50.16 U$61.1
  Bottom 0.61: v84.14,47.62 80.01,47.62 79.38,48.26 79.38,49.53 78.74,50.16 76.52,50.16 v75.25,51.44
N$31  (via drill 0.6)
  Top 0.61: R46.2 | R45.2 R46.2 | R46.2 77.47,39.69 v76.84,40.32 | v83.19,43.81 83.19,45.14 U$61.5
  Bottom 0.61: v76.84,40.32 79.69,40.32 v83.19,43.81
N$32
  Top 0.305: 84.45,73.03 83.82,72.39 U$63.7
  Top 0.61: R25.1 86.04,74.61 84.45,73.03
N$33
  Top 0.61: U$28.1 88.9,73.66 87.95,72.71 86.68,72.71 R25.2
N$34
  Top 0.61: U$26.1 85.87,51.29 R32.2
N$35
  Top 0.61: R20.2 U$18.1
N$37
  Top 0.61: R41.1 51.44,92.07 50.48,93.03 46.67,93.03 U$71.C 43.82,90.17 39.37,90.17 | U$66.3 39.37,90.17 | U$66.1 38.74,88.27 39.37,88.9 39.37,90.17
N$38  (via drill 0.6)
  Top 0.61: U$63.5 83.5,69.85 84.14,69.22 84.14,67.63 v83.82,67.31 | R44.2 87,63.82 v87.31,64.13 R43.2
  Bottom 0.61: v87.31,64.13 87,64.13 v83.82,67.31
N$39  (via drill 0.6)
  Top 0.61: R48.2 R47.2 85.09,22.23 v84.14,22.23 | U$60.5 81.66,26.93 82.23,26.35 v82.23,25.08
  Bottom 0.61: v82.23,25.08 82.23,24.13 v84.14,22.23
N$40
  Top 0.406: U$60.7 82.87,29.85 83.19,30.16 84.45,30.16 84.77,29.85 R20.1
N$41  (via drill 0.6)
  Top 0.61: v42.55,75.88 R52.2 R49.2 | U$24.5 46.99,46.99 v47.62,46.36
  Bottom 0.61: v42.55,75.88 42.86,75.56 42.86,70.8 47.62,66.04 47.62,58.74 45.09,56.2 45.09,48.9 v47.62,46.36
N$42  (via drill 0.6)
  Top 0.61: C1.1 42.86,80.96 | 42.86,80.96 43.81,80.01 R50.1 45.4,80.65 v45.4,82.55 | U$67.2 44.13,66.67 45.72,68.26 45.72,70.48 46.04,70.8 v46.04,75.25 | R1.2 42.55,80.65 42.86,80.96
  Bottom 0.61: 45.09,82.23 v45.4,82.55 46.04,81.91 v46.04,75.25
OCP_ADC_SWITCH  (via drill 0.6)  (1 unrouted)
  Top 0.305: 35.56,67.63 35.56,65.09 35.88,64.77 U$67.1
  Top 0.406: 89.22,62.55 86.68,62.55 86.36,62.23 86.04,62.23
  Top 0.61: R38.1 R37.2 | U$68.1 36.2,68.9 35.56,68.26 35.56,67.63 | U$28.3 91.93,76.03 v93.03,74.93 | v93.03,70.17 93.03,69.53 92.08,68.58 90.17,68.58 89.22,67.63 89.22,62.55 89.22,56.52 87.95,55.24 87.95,53.98 | 87.95,53.98 U$26.3 | U$18.3 88.9,45.72 91.12,47.94 91.12,52.7 89.85,53.98 87.95,53.98 | U$67.1 43.81,64.77 46.36,62.23 86.04,62.23
  Bottom 0.61: v93.03,74.93 v93.03,70.17
OCP_EN_GATE  (via drill 0.6)
  Top 0.61: R37.1 R36.2 94.61,79.06 95.25,78.42 95.25,63.5 92.71,60.96 v91.12,60.96 | v87.63,60.96 46.04,60.96 43.5,63.5 36.51,63.5 v33.34,60.33
  Bottom 0.61: v87.63,60.96 v91.12,60.96 | v33.34,60.33 31.75,60.33 A/D.12
PEDAL  (via drill 0.6)
  Top 0.61: U$66.4 35.24,90.2 v35.24,92.07 R40.2
  Bottom 0.61: SV1.4 26.04,80.01 24.45,81.6 24.45,83.19 33.34,92.07 v35.24,92.07
TP  (via drill 0.6)
  Top 0.61: R42.2 C10.2 | v45.4,85.41 48.58,85.41 49.21,86.04 C10.2 | C10.2 51.11,87.31 R41.2
  Bottom 0.61: 45.09,85.09 v45.4,85.41 40.96,80.96 40.96,71.75 35.24,66.04 35.24,63.5 33.97,62.23 A/D.8
V_REF  (via drill 0.6)
  Top 0.61: R26.2 76.2,82.56 U$44.2 76.2,81.6 C35.1 | R13.1 75.56,65.72 75.41,65.88 | v73.34,71.44 73.34,67.94 75.41,65.88 | R26.2 | R26.2 74.93,80.01 73.66,78.74 v73.66,77.47 | R30.1 73.34,42.23 v70.48,45.09 | v73.34,65.72 75.25,65.72 75.41,65.88 | R17.1 70.8,23.18 69.22,24.77 v69.22,25.72
  Bottom 0.61: 73.03,65.41 v73.34,65.72 73.34,54.61 70.48,51.75 v70.48,45.09 70.48,39.37 72.07,37.78 72.07,33.34 69.22,30.48 v69.22,25.72 | v73.66,77.47 73.66,71.75 v73.34,71.44

### Text on the board
Top: Rev. 3 Top
Bottom: Rev. 3 Bottom